# EasyEDA schematic Prática-13.json
TITLE: Sheet_1; REV: 1.0; Date: 2020-11-25; Sheet: 1/1; Drawn By: mrrbcc; Company: Your Company
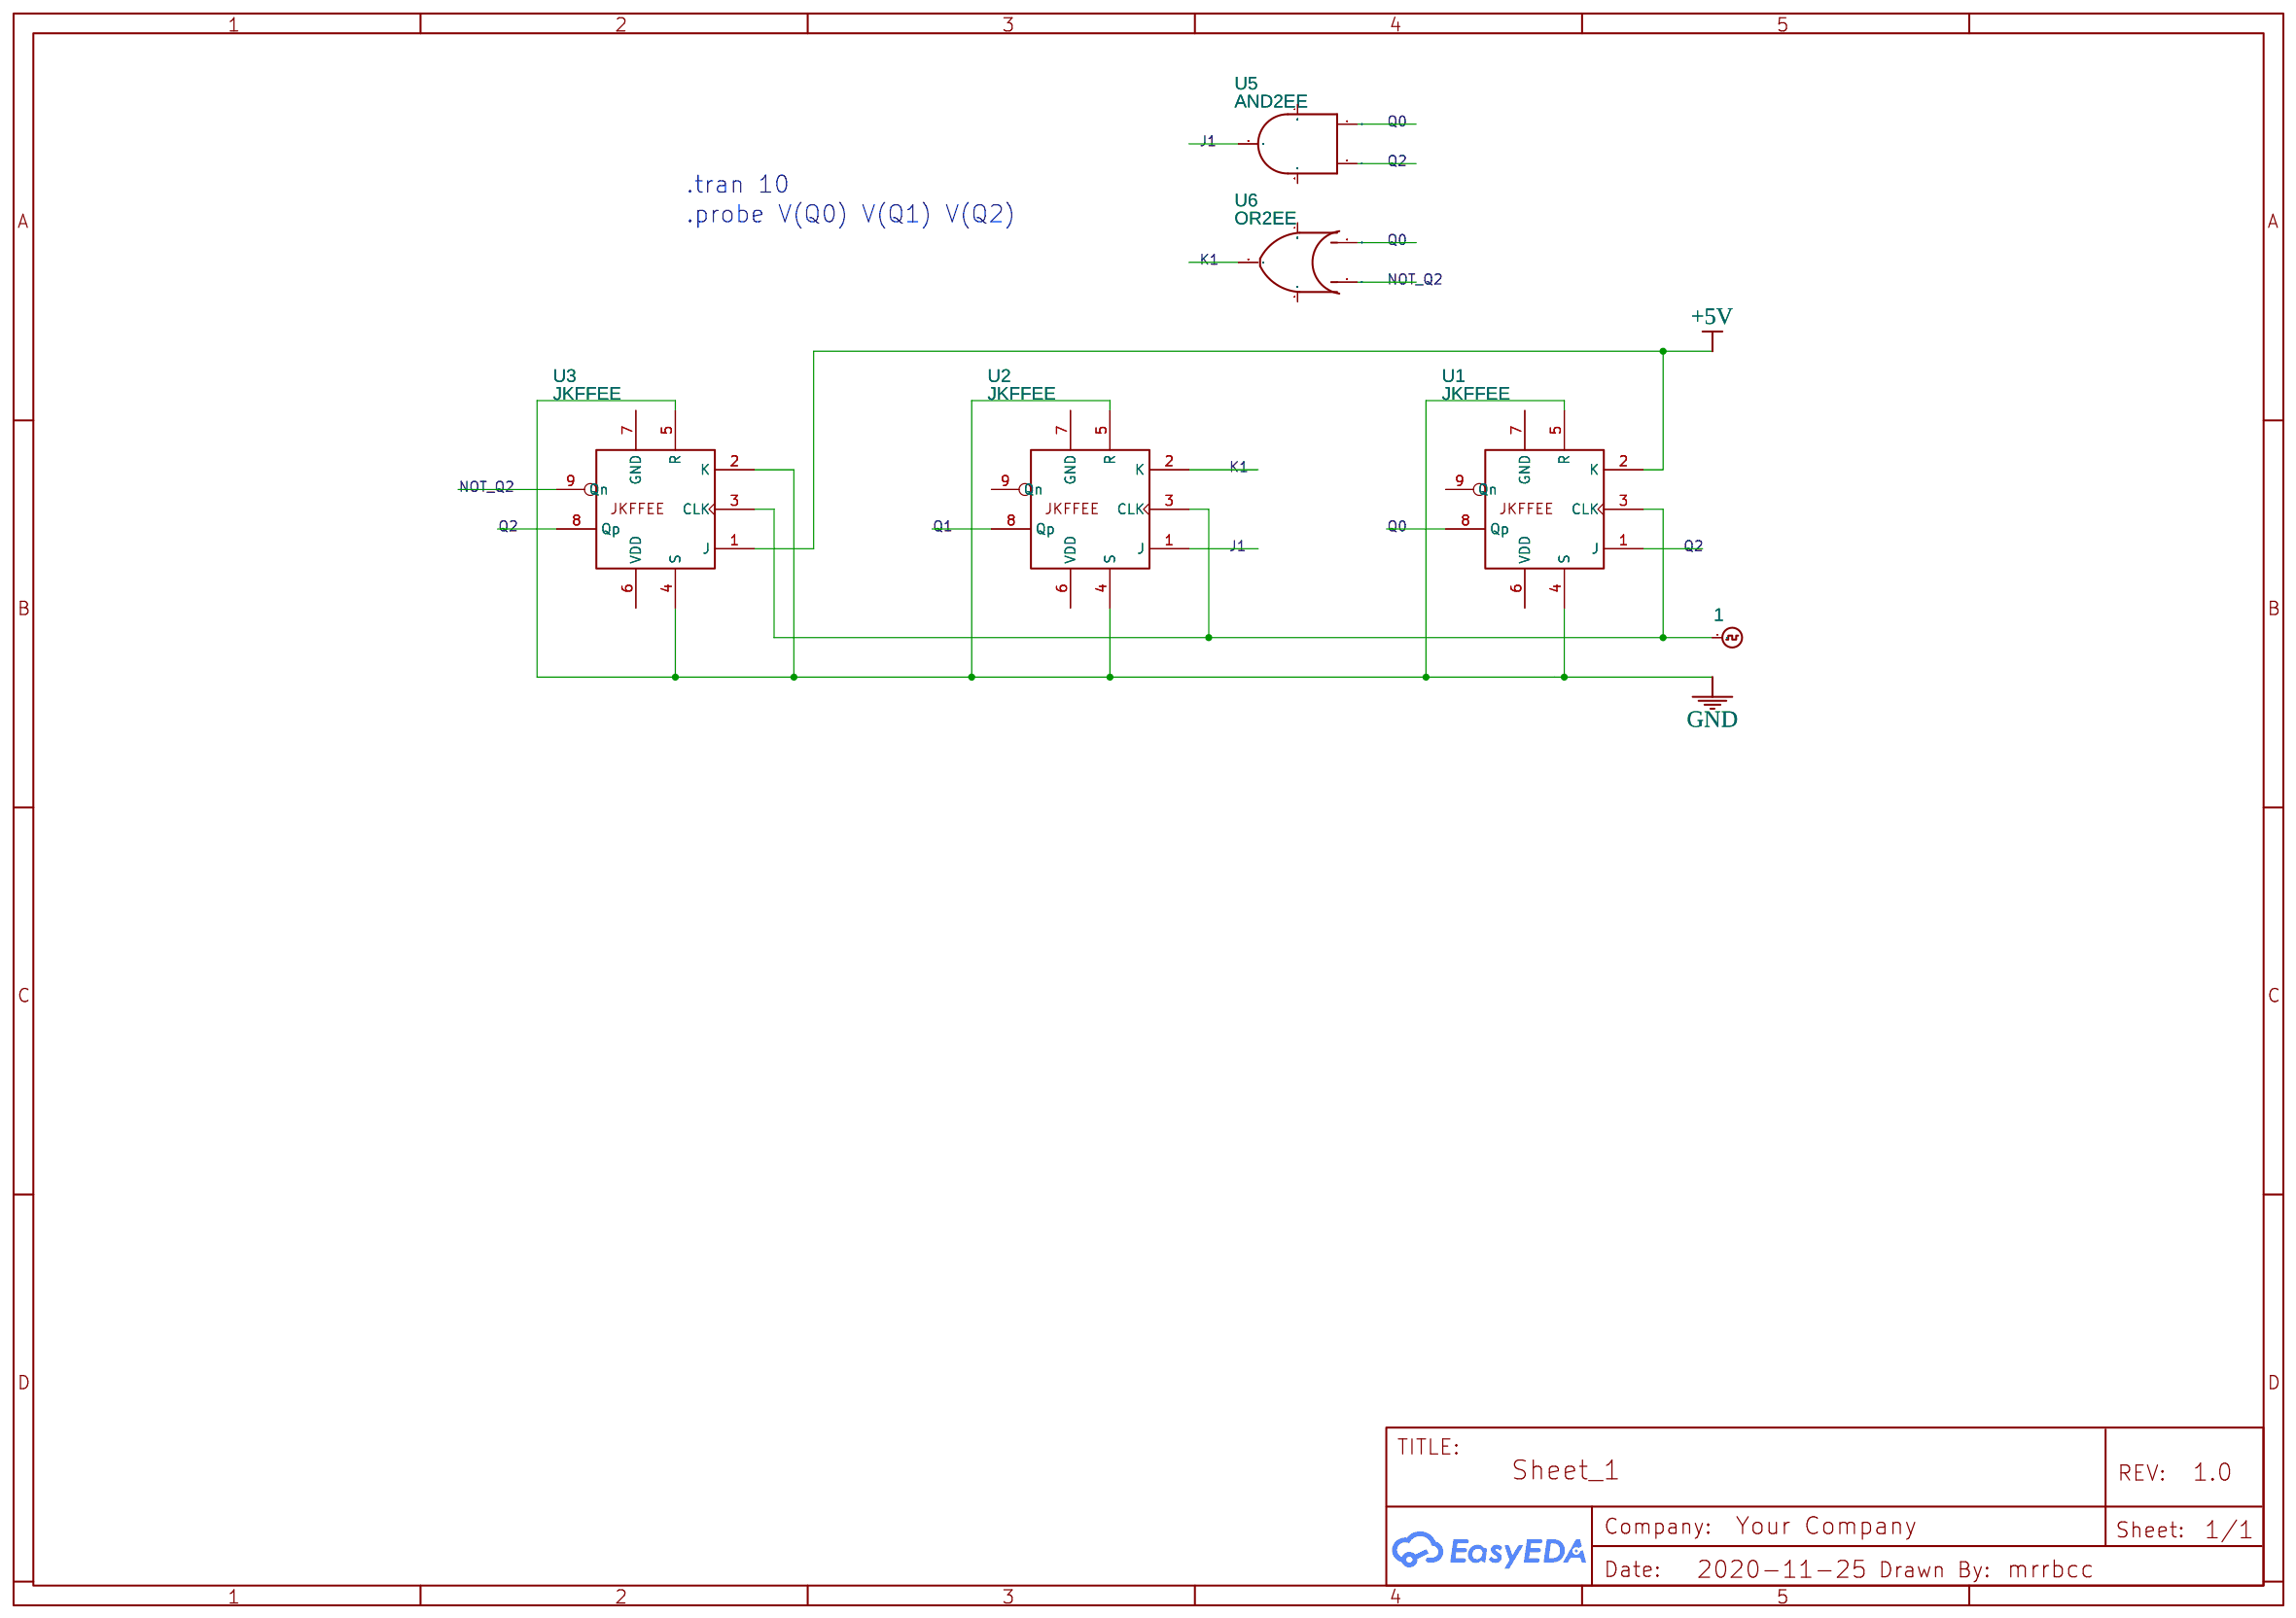
[diagram p0: schematic sheet]

## Parts
U1  JKFFEE
U2  JKFFEE
U3  JKFFEE
U4  1
U5  AND2EE
U6  OR2EE

## Library data of the parts
U1-U3 = LOGIC: Contributor: EasyEDA; sourceId: 8C82kBTN5; Supplier: YUJING
U4 = DIGITALCLOCK: Contributor: EasyEDA; PreDisplay: 0
U5 U6 = LOGIC: Contributor: EasyEDA

## Nets
+5V: U1.2(K) U3.1(J)
GND: U1.4(S) U1.5(R) U2.4(S) U2.5(R) U3.2(K) U3.4(S) U3.5(R)
J1: U2.1(J) U5.5(OUT)
K1: U2.2(K) U6.5(OUT)
NOT_Q2: U3.9(Qn) U6.1(INA)
Q0: U1.8(Qp) U5.2(INB) U6.2(INB)
Q1: U2.8(Qp)
Q2: U1.1(J) U3.8(Qp) U5.1(INA)
Net-(U1-3): U1.3(CLK) U2.3(CLK) U3.3(CLK) U4.1

Not connected (* = marked no-connect by the designer): U1 6(VDD) 7(GND) 9(Qn); U2 6(VDD) 7(GND) 9(Qn); U3 6(VDD) 7(GND); U5 3(VDD) 4(GND); U6 3(VDD) 4(GND)

## Notes on the sheet
- .tran 10
- .probe V(Q0) V(Q1) V(Q2)
